# Altium schematic sheet PCIE_CLK.SchDoc: =project_title
size Tabloid; CompanyName: Luxonis Holding; Organization: Luxonis Holding; Address1: 1925 Harmony Park Drive; Address2: Westminster, CO; Address3: 80234; Address4: United States; SheetNumber: 4; SheetTotal: 15
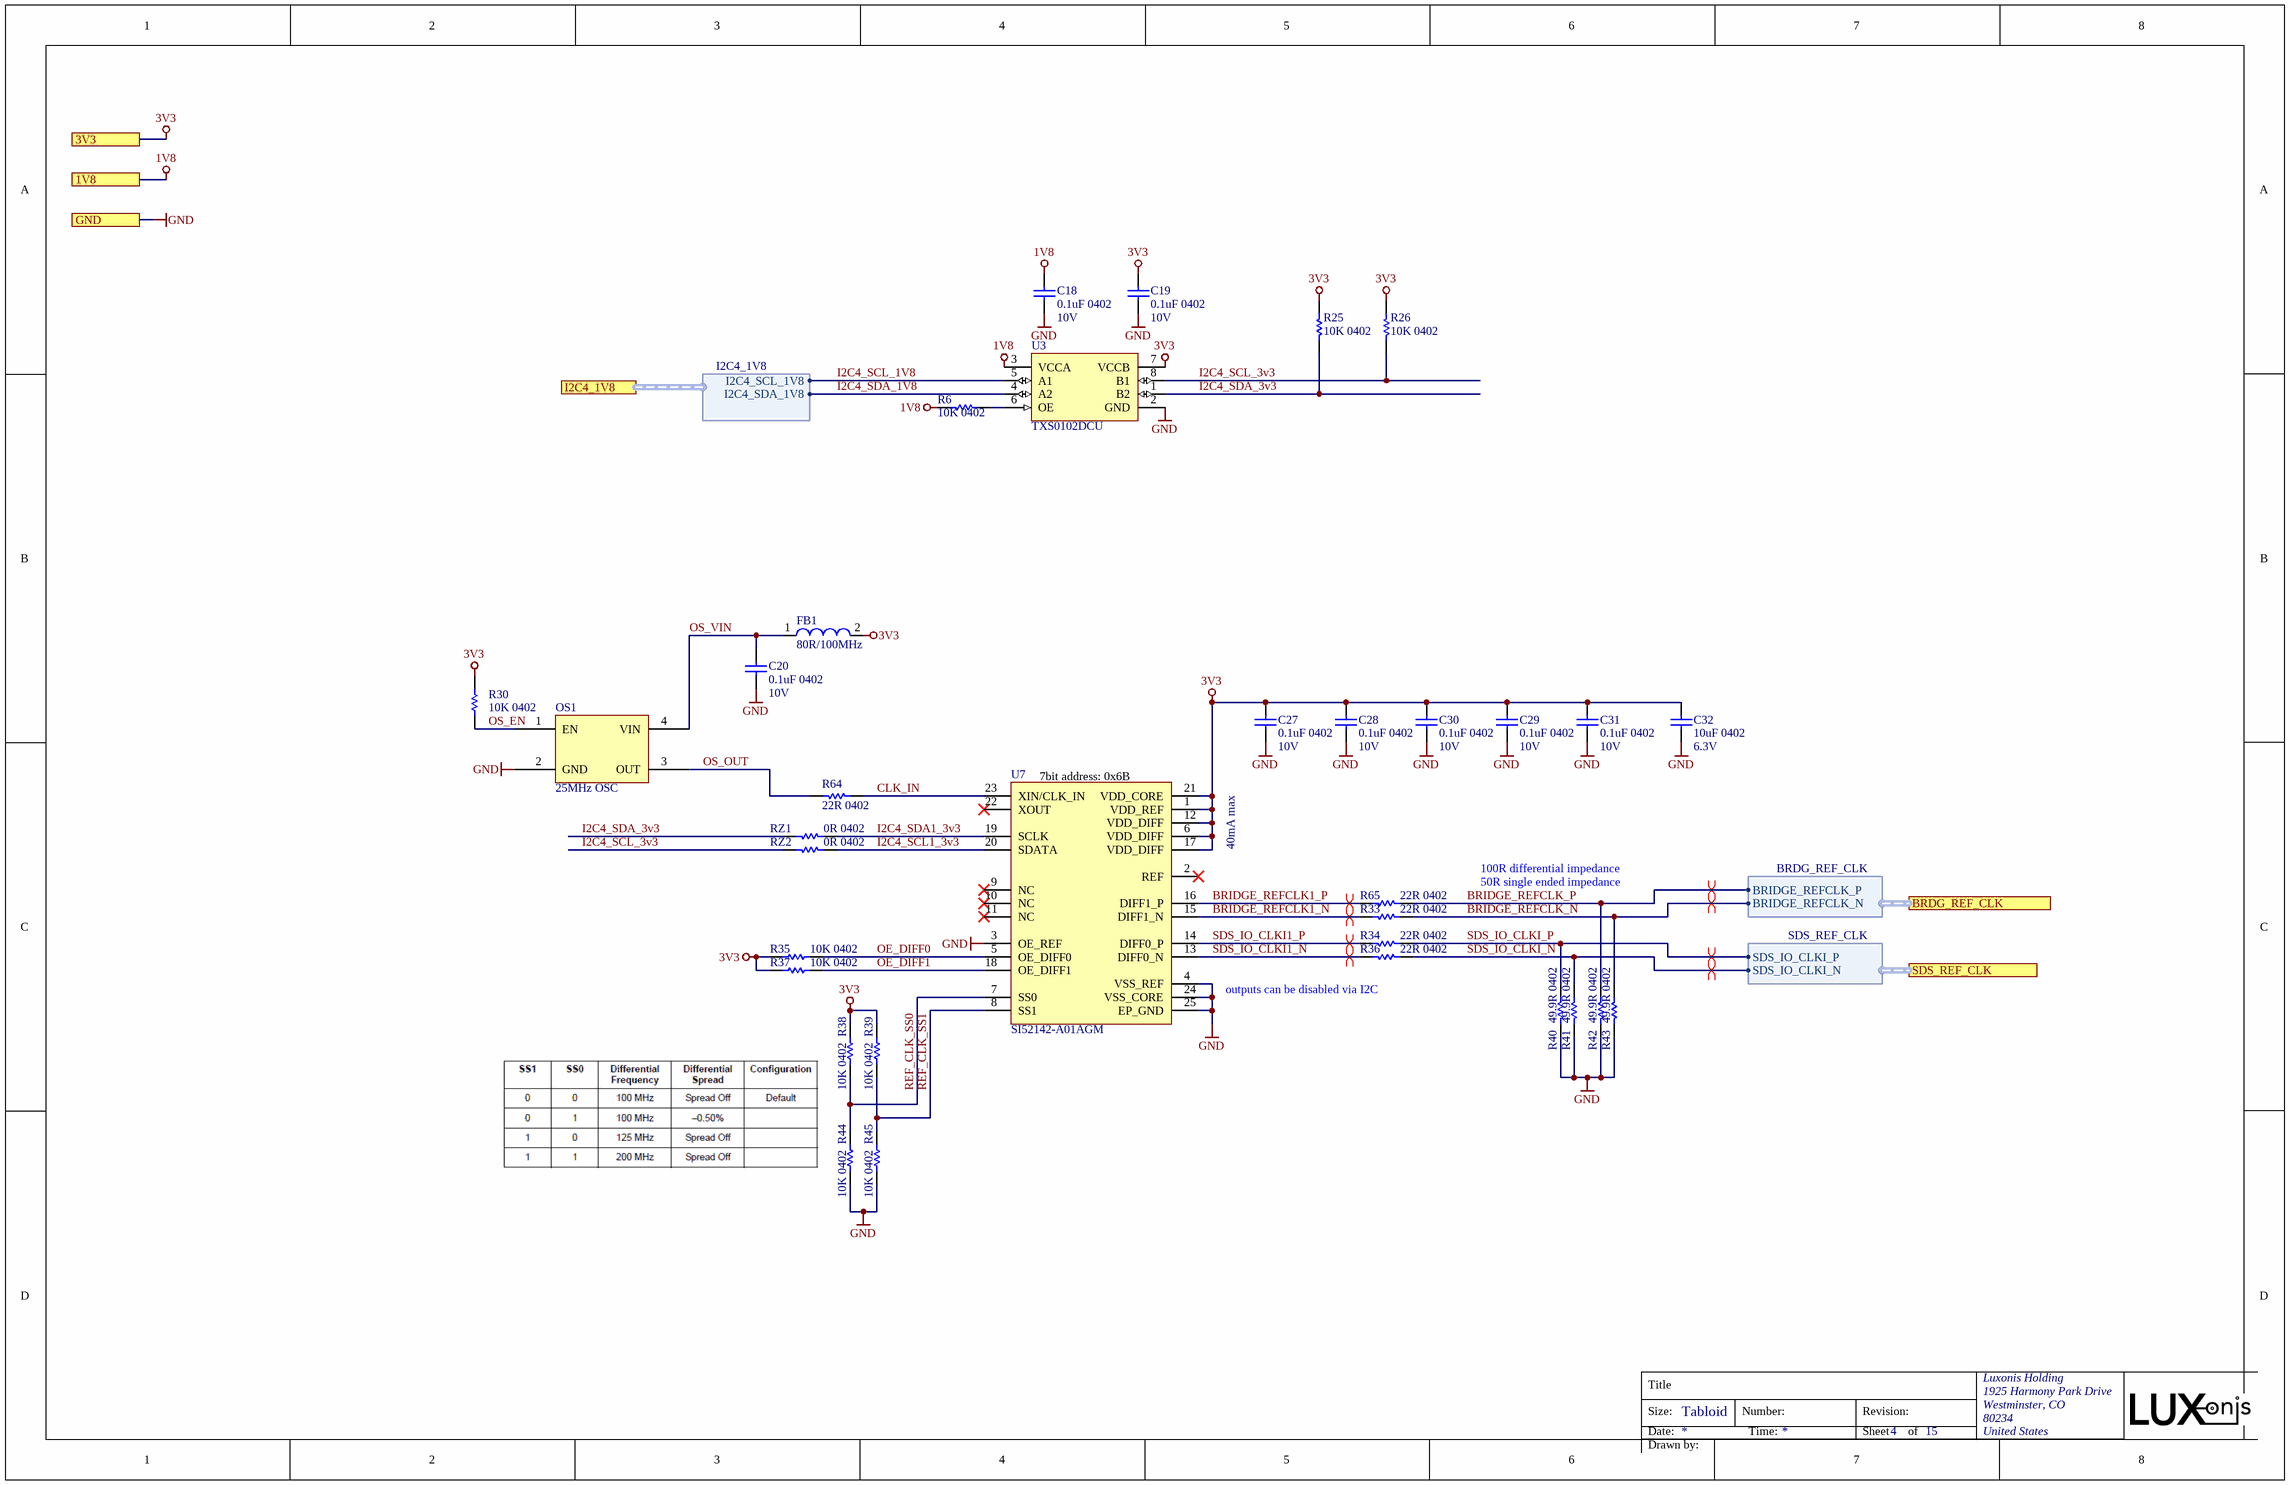
[diagram p0: PCIE_CLK.SchDoc]

## Parts
C18  0.1uF 0402  Voltage Rating: 10V  [CAPC0402(1005)70_N]
C19  0.1uF 0402  Voltage Rating: 10V  [CAPC0402(1005)70_N]
C20  0.1uF 0402  Voltage Rating: 10V  [CAPC0402(1005)70_N]
C27  0.1uF 0402  Voltage Rating: 10V  [CAPC0402(1005)70_N]
C28  0.1uF 0402  Voltage Rating: 10V  [CAPC0402(1005)70_N]
C29  0.1uF 0402  Voltage Rating: 10V  [CAPC0402(1005)70_N]
C30  0.1uF 0402  Voltage Rating: 10V  [CAPC0402(1005)70_N]
C31  0.1uF 0402  Voltage Rating: 10V  [CAPC0402(1005)70_N]
C32  10uF 0402  Voltage Rating: 6.3V  [CAPC0402(1005)70_N]
FB1  80R/100MHz  [BK1608HS800-T_N]
OS1  25MHz OSC  [ASDMB-25.000MHZ-LC-T]
R6  10K 0402  [RESC0402(1005)_N]
R25  10K 0402  [RESC0402(1005)_N]
R26  10K 0402  [RESC0402(1005)_N]
R30  10K 0402  [RESC0402(1005)_N]
R33  22R 0402  [RESC0402(1005)_L]
R34  22R 0402  [RESC0402(1005)_L]
R35  10K 0402  [RESC0402(1005)_N]
R36  22R 0402  [RESC0402(1005)_L]
R37  10K 0402  [RESC0402(1005)_N]
R38  10K 0402  [RESC0402(1005)_N]
R39  10K 0402  [RESC0402(1005)_N]
R40  49.9R 0402  [RESC0402(1005)_L]
R41  49.9R 0402  [RESC0402(1005)_L]
R42  49.9R 0402  [RESC0402(1005)_L]
R43  49.9R 0402  [RESC0402(1005)_L]
R44  10K 0402  [RESC0402(1005)_N]
R45  10K 0402  [RESC0402(1005)_N]
R64  22R 0402  [RESC0402(1005)_N]
R65  22R 0402  [RESC0402(1005)_L]
RZ1  0R 0402  [RESC0402(1005)_N]
RZ2  0R 0402  [RESC0402(1005)_N]
U3  TXS0102DCU  [TXS0102DCUR]
U7  SI52142-A01AGM  [SI52142-A01AGM]

## Ports
1V8, 3V3, BRDG_REF_CLK (harness BRDG_REF_CLK), GND, I2C4_1V8 (harness I2C4_1V8), SDS_REF_CLK (harness SDS_REF_CLK)

## Harnesses
BRDG_REF_CLK: BRIDGE_REFCLK_P, BRIDGE_REFCLK_N
SDS_REF_CLK: SDS_IO_CLKI_P, SDS_IO_CLKI_N
I2C4_1V8: I2C4_SDA_1V8, I2C4_SCL_1V8

## Nets
1V8: C18.2 R6.2 U3.3(VCCA) ; port 1V8
3V3: C19.2 C27.1 C28.1 C29.1 C30.1 C31.1 C32.2 FB1.2 R25.1 R26.1 R30.2 R35.1 R37.1 R38.1 R39.1 U3.7(VCCB) U7.1(VDD_REF) U7.6(VDD_DIFF) U7.12(VDD_DIFF) U7.17(VDD_DIFF) U7.21(VDD_CORE) ; port 3V3
GND: C18.1 C19.1 C20.2 C27.2 C28.2 C29.2 C30.2 C31.2 C32.1 OS1.2(GND) R40.2 R41.1 R42.1 R43.1 R44.2 R45.2 U3.2(GND) U7.3(OE_REF) U7.4(VSS_REF) U7.24(VSS_CORE) U7.25(EP_GND) ; port GND
BRIDGE_REFCLK1_N: R33.2 U7.15(DIFF1_N)
BRIDGE_REFCLK1_P: R65.2 U7.16(DIFF1_P)
BRIDGE_REFCLK_N: R33.1 R43.2 ; port BRDG_REF_CLK.BRIDGE_REFCLK_N
BRIDGE_REFCLK_P: R42.2 R65.1 ; port BRDG_REF_CLK.BRIDGE_REFCLK_P
CLK_IN: R64.1 U7.23(XIN/CLK_IN)
I2C4_SCL1_3v3: RZ2.2 U7.20(SDATA)
I2C4_SCL_1V8: U3.5(A1) ; port I2C4_1V8.I2C4_SCL_1V8
I2C4_SCL_3v3: R26.2 RZ2.1 U3.8(B1)
I2C4_SDA1_3v3: RZ1.2 U7.19(SCLK)
I2C4_SDA_1V8: U3.4(A2) ; port I2C4_1V8.I2C4_SDA_1V8
I2C4_SDA_3v3: R25.2 RZ1.1 U3.1(B2)
OE_DIFF0: R35.2 U7.5(OE_DIFF0)
OE_DIFF1: R37.2 U7.18(OE_DIFF1)
OS_EN: OS1.1(EN) R30.1
OS_OUT: OS1.3(OUT) R64.2
OS_VIN: C20.1 FB1.1 OS1.4(VIN)
REF_CLK_SS0: R38.2 R44.1 U7.7(SS0)
REF_CLK_SS1: R39.2 R45.1 U7.8(SS1)
SDS_IO_CLKI1_N: R36.2 U7.13(DIFF0_N)
SDS_IO_CLKI1_P: R34.2 U7.14(DIFF0_P)
SDS_IO_CLKI_N: R36.1 R41.2 ; port SDS_REF_CLK.SDS_IO_CLKI_N
SDS_IO_CLKI_P: R34.1 R40.1 ; port SDS_REF_CLK.SDS_IO_CLKI_P
NetR6_1: R6.1 U3.6(OE)

Not connected (* = marked no-connect by the designer): U7 2(REF)* 9(NC)* 10(NC)* 11(NC)* 22(XOUT)*

## Layout directives
differential pair; differential pair class 100ohm: BRIDGE_REFCLK1_N, BRIDGE_REFCLK1_P, BRIDGE_REFCLK_N, BRIDGE_REFCLK_P, SDS_IO_CLKI1_N, SDS_IO_CLKI1_P, SDS_IO_CLKI_N, SDS_IO_CLKI_P

## Notes on the sheet
- (near U7) 7bit address: 0x6B
- 40mA max
- 100R differential impedance
- 50R single ended impedance
- outputs can be disabled via I2C
- Schematic based on the PCIe refclk and control circuitry on the MV0235 reference design.
- Title
- Size:
- Date:
- Tabloid
- Number:
- Time:
- Revision:
- Sheet
- of
- Drawn by:

## Library data of the parts
C18-C20 C27-C31 = GRM155R71A104JA01D: CAP CER 0.1UF 10V X7R 0402 5%; Manufacturer 1: Murata; Capacitance: 100nF; Supplier 1: Digi-Key; Manufacturer Part Number 1: GRM155R71A104JA01D; Stock 1: 1346709; Pricing 1: 1=0.10000, 10=0.02500, 100=0.01130, 500=0.00806, 1000=0.00633, 2500=0.00575, 5000=0.00529 (USD); RoHS: Yes; Mount: Surface Mount; Case/Package: 0402; Case Code (Imperial): 0402; Case Code (Metric): 1005; Min Operating Temperature: -55°C; Max Operating Temperature: 125°C; Tolerance: 5%; Packaging: Tape and Reel; Voltage Rating (DC): 10V; Dielectric: X7R; Package Quantity: 10000; Termination: SMD/SMT; Length: 1mm; Height: 0.5mm; Width: 0.02inch; Thickness: 0.022inch; Depth: 0.5mm; Radiation Hardening: No; Lead Free: Lead Free; ComponentLink1URL: https://datasheet.ciiva.com/5411/product-5411135.pdf?src-supplier=Mouser; ComponentLink1Description: https://datasheet.ciiva.com/5411/product-5411135.pdf?src-supplier=Mouser; ComponentLink2URL: https://datasheet.ciiva.com/11618/c02e-11618821.pdf?src-supplier=Avnet; ComponentLink2Description: https://datasheet.ciiva.com/11618/c02e-11618821.pdf?src-supplier=Avnet; Supplier Part Number 1: 490-10777-1-ND
C32 = GRM155R60J106ME15D: CAP CER 10UF 6.3V X5R 0402 20%; Manufacturer 1: Murata; Supplier 1: Digi-Key; Manufacturer Part Number 1: GRM155R60J106ME15D; Stock 1: 1839627; Pricing 1: 1=0.23000, 10=0.15700, 100=0.07950, 500=0.05442, 1000=0.04814, 2500=0.04605, 5000=0.04186 (USD); RoHS: Yes; Mount: Surface Mount; Case/Package: 0402; Case Code (Metric): 1005; Case Code (Imperial): 0402; Min Operating Temperature: -55°C; Max Operating Temperature: 85°C; Packaging: Tape and Reel; Capacitance: 10uF; Dielectric: X5R; Length: 0.039inch; Width: 0.02inch; ComponentLink1URL: https://www.murata.com/~/media/webrenewal/support/library/catalog/products/capacitor/mlcc/c02e.ashx?la=en-us&src-supplier=Digi-Key; ComponentLink1Description: https://www.murata.com/~/media/webrenewal/support/library/catalog/products/capacitor/mlcc/c02e.ashx?la=en-us&src-supplier=Digi-Key; Supplier Part Number 1: 490-13238-1-ND; Voltage Rating (DC): 6.3V; Thickness: 0.026inch; Tolerance: 20%
FB1 = BK1608HS800-T: FERRITE BEAD 80 OHM 0603 1LN; Manufacturer 1: Taiyo Yuden; Impedance: 80R; Tolerance: 25%; Max DC Current: 600mA; DC Resistance (DCR): 100mR; Test Frequency: 100MHz; Number of Lines: 1; Shielding: Shielded; Supplier 1: Digi-Key; Manufacturer Part Number 1: BK1608HS800-T; Stock 1: 6285; Pricing 1: 1=0.10000, 10=0.07900, 25=0.07200, 50=0.06480, 100=0.04760, 250=0.03460, 500=0.03170, 1000=0.02738 (USD); RoHS: Yes; Mount: Surface Mount; Case/Package: 0603; Number of Pins: 2; Core Material: Ferrite; Case Code (Metric): 1608; Case Code (Imperial): 0603; Min Operating Temperature: -55°C; Max Operating Temperature: 125°C; Package Quantity: 1; Packaging: Tape and Reel; Termination: SMD/SMT; Max Current Rating: 600mA; Frequency: 100MHz; Length: 0.063inch; Height: 0.037inch; Width: 0.8mm; Depth: 0.95mm; REACH SVHC: Unknown; Lead Free: Lead Free; Halogen Free: Halogen Free; ComponentLink1URL: https://datasheet.ciiva.com/1011/bk1608hs800-t-ss-1011885.pdf?src-supplier=Digi-Key; ComponentLink1Description: https://datasheet.ciiva.com/1011/bk1608hs800-t-ss-1011885.pdf?src-supplier=Digi-Key; ComponentLink2URL: https://datasheet.ciiva.com/1011/mlci07-e-1011886.pdf?src-supplier=Digi-Key; ComponentLink2Description: https://datasheet.ciiva.com/1011/mlci07-e-1011886.pdf?src-supplier=Digi-Key; ComponentLink3URL: https://datasheet.ciiva.com/1011/mlci07-e-1011887.pdf?src-supplier=Digi-Key; ComponentLink3Description: https://datasheet.ciiva.com/1011/mlci07-e-1011887.pdf?src-supplier=Digi-Key; Supplier 2: Mouser; Supplier 3: Arrow; Supplier Part Number 1: 587-1875-1-ND; Supplier Part Number 2: 963-BK1608HS800-T; Supplier Part Number 3: BK1608HS800-T
OS1 = ASDMB-25.000MHZ-LC-T: MEMS OSC XO 25.0000MHZ LVCMOS; Manufacturer 1: Abracon; Load Capacitance: 15pF; Operating Supply Voltage: 3.3V; Max Supply Voltage: 4V; Min Supply Voltage: -300mV; Max Supply Current: 16mA; Frequency Stability: 50ppm; Supplier 1: Digi-Key; Manufacturer Part Number 1: ASDMB-25.000MHZ-LC-T; RoHS: Yes; Category: Oscillators; Stock 1: 3088; Pricing 1: 1=2.09000, 10=1.99800, 50=1.95200, 100=1.67310, 500=1.62662 (USD); Mount: Surface Mount; Case/Package: SMD/SMT; Number of Pins: 4; Min Operating Temperature: -40°C; Max Operating Temperature: 85°C; Packaging: Tape and Reel; Frequency: 25MHz; Termination: SMD/SMT; Length: 0.098inch; Height: 0.035inch; Width: 0.079inch; Lead Free: Lead Free; ComponentLink1URL: https://datasheet.ciiva.com/868/asdmb-868249.pdf?src-supplier=Digi-Key; ComponentLink1Description: https://datasheet.ciiva.com/868/asdmb-868249.pdf?src-supplier=Digi-Key; ComponentLink2URL: https://datasheet.ciiva.com/868/asdmb-868250.pdf?src-supplier=Digi-Key; ComponentLink2Description: https://datasheet.ciiva.com/868/asdmb-868250.pdf?src-supplier=Digi-Key; ComponentLink3URL: https://datasheet.ciiva.com/868/asdmb-868251.pdf?src-supplier=Digi-Key; ComponentLink3Description: https://datasheet.ciiva.com/868/asdmb-868251.pdf?src-supplier=Digi-Key; ComponentLink4URL: https://datasheet.ciiva.com/13166/asdmb-29928-13166571.pdf?src-supplier=Mouser; ComponentLink4Description: https://datasheet.ciiva.com/13166/asdmb-29928-13166571.pdf?src-supplier=Mouser; Supplier 2: Newark; Supplier 3: Mouser; Supplier Part Number 3: 815-ASDMB-25MHZ-LC; Supplier Part Number 2: 56AC7555; Supplier Part Number 1: 535-11730-1-ND
R6 R25 R26 R30 R35 R37-R39 R44 R45 = RC0402FR-1310KL: RES SMD 10K OHM 1% 0402 1/16W Chip Resistor, 0402 [1005 Metric], 10 kohm, RC Series, 50 V, Thick Film, 62.5 mW; Manufacturer 1: Yageo; Resistance: 10kR; Temperature Coefficient: 100ppm/°C; Power Rating: 62.5mW; Voltage Rating: 50V; ComponentLink1URL: https://datasheet.ciiva.com/16940/pyu-rc0402-51-rohs-l-6-16940293.pdf?src-supplier=Avnet+Europe; ComponentLink1Description: https://datasheet.ciiva.com/16940/pyu-rc0402-51-rohs-l-6-16940293.pdf?src-supplier=Avnet+Europe; ComponentLink2URL: https://datasheet.ciiva.com/28386/pyu-rc0402-51-rohs-l-6-28386855.pdf?src-supplier=Avnet+Europe; ComponentLink2Description: https://datasheet.ciiva.com/28386/pyu-rc0402-51-rohs-l-6-28386855.pdf?src-supplier=Avnet+Europe; ComponentLink3URL: https://datasheet.ciiva.com/16740/pyu-rc0402-51-rohs-l-6-r-16740602.pdf?src-supplier=Future+Electronics; ComponentLink3Description: https://datasheet.ciiva.com/16740/pyu-rc0402-51-rohs-l-6-r-16740602.pdf?src-supplier=Future+Electronics; ComponentLink4URL: https://datasheet.ciiva.com/8891/pyu-rc0402-51-rohs-l-6-8891339.pdf?src-supplier=Avnet; ComponentLink4Description: https://datasheet.ciiva.com/8891/pyu-rc0402-51-rohs-l-6-8891339.pdf?src-supplier=Avnet; ComponentLink5URL: https://datasheet.ciiva.com/5557/pyu-rc0402-51-rohs-l-6-r-5557997.pdf?src-supplier=Mouser; ComponentLink5Description: https://datasheet.ciiva.com/5557/pyu-rc0402-51-rohs-l-6-r-5557997.pdf?src-supplier=Mouser; ComponentLink6URL: https://datasheet.ciiva.com/7983/1018594-7983533.pdf?src-supplier=Element14; ComponentLink6Description: https://datasheet.ciiva.com/7983/1018594-7983533.pdf?src-supplier=Element14; Supplier 1: Newark; Manufacturer Part Number 1: RC0402FR-1310KL; Stock 1: 62239; Pricing 1: 1=0.10000, 25=0.01200, 100=0.00400, 250=0.00400, 500=0.00300, 1000=0.00300 (USD); RoHS: Yes; Case/Package: 0402; Number of Pins: 2; Contact Plating: Tin,Matte,Lead; Case Code (Imperial): 0402; Case Code (Metric): 1005; Min Operating Temperature: -55°C; Max Operating Temperature: 155°C; Tolerance: 1%; Composition: Thick Film; Packaging: Tape and Reel; Termination: SMD/SMT; Military Standard: Not; Voltage Rating (DC): 50V; Working Voltage: 50V; Number of Terminations: 2; Length: 1mm; Depth: 0.5mm; Radiation Hardening: No; REACH SVHC: No SVHC; Lead Free: Lead Free; Supplier Part Number 1: 67R9960; Supplier 2: Future Electronics; Supplier 3: Mouser; Supplier 4: Element14; Supplier Part Number 2: RC0402FR-1310KL-CUTT; Supplier Part Number 3: 603-RC0402FR-1310KL; Supplier Part Number 4: 1799235
R33 R34 R36 R64 R65 = RC0402FR-0722RL: RES SMD 22 OHM 1% 1/16W 0402; Manufacturer 1: Yageo; Temperature Coefficient: 100ppm/°C; Power Rating: 63mW; Voltage Rating: 50V; Supplier 1: Digi-Key; Manufacturer Part Number 1: RC0402FR-0722RL; Stock 1: 23751364; Pricing 1: 10000=0.00163, 30000=0.00144, 50000=0.00132, 100000=0.00129 (USD); RoHS: Yes; Case/Package: 0402; Number of Pins: 2; Case Code (Metric): 1005; Case Code (Imperial): 0402; Min Operating Temperature: -55°C; Max Operating Temperature: 155°C; Tolerance: 1%; Resistance: 22R; Packaging: Tape and Reel; Composition: Thick Film; Voltage Rating (DC): 50V; Termination: SMD/SMT; Military Standard: Not; Length: 1mm; Height: 0.32mm; Width: 0.5mm; Depth: 0.5mm; REACH SVHC: Unknown; Lead Free: Lead Free; ComponentLink1URL: https://datasheet.ciiva.com/11819/0900766b80c66297-11819462.pdf?src-supplier=RSComponents; ComponentLink1Description: https://datasheet.ciiva.com/11819/0900766b80c66297-11819462.pdf?src-supplier=RSComponents; ComponentLink2URL: https://datasheet.ciiva.com/7849/1018594-7849911.pdf?src-supplier=Element14; ComponentLink2Description: https://datasheet.ciiva.com/7849/1018594-7849911.pdf?src-supplier=Element14; ComponentLink3URL: https://datasheet.ciiva.com/26829/getdatasheetpartid-554995-26829991.pdf?src-supplier=Verical; ComponentLink3Description: https://datasheet.ciiva.com/26829/getdatasheetpartid-554995-26829991.pdf?src-supplier=Verical; ComponentLink4URL: https://datasheet.ciiva.com/7849/1018594-7849912.pdf?src-supplier=Element14; ComponentLink4Description: https://datasheet.ciiva.com/7849/1018594-7849912.pdf?src-supplier=Element14; ComponentLink5URL: https://datasheet.ciiva.com/16930/pyu-rc0402-51-rohs-l-6-r-16930687.pdf?src-supplier=Future+Electronics; ComponentLink5Description: https://datasheet.ciiva.com/16930/pyu-rc0402-51-rohs-l-6-r-16930687.pdf?src-supplier=Future+Electronics; Supplier 2: Newark; Supplier 3: Mouser; Supplier Part Number 2: 26M6784; Supplier Part Number 3: 603-RC0402FR-0722RL; Supplier Part Number 1: 311-22.0LRTR-ND
R40-R43 = RC0402FR-0749R9L: RES SMD 49.9 OHM 1% 1/16W 0402; Manufacturer 1: Yageo; Power Rating: 62.5mW; Temperature Coefficient: 100ppm/°C; Voltage Rating: 50V; Max Power Dissipation: 63mW; Supplier 1: Digi-Key; Manufacturer Part Number 1: RC0402FR-0749R9L; Stock 1: 15110719; Pricing 1: 1=0.10000, 10=0.01600, 100=0.00640, 1000=0.00289, 2500=0.00251, 5000=0.00207 (USD); RoHS: Yes; Case/Package: 0402; Number of Pins: 2; Case Code (Imperial): 0402; Case Code (Metric): 1005; Min Operating Temperature: -55°C; Max Operating Temperature: 155°C; Packaging: Tape and Reel; Resistance: 49.9R; Tolerance: 1%; Composition: Thick Film; Number of Terminations: 2; Package Quantity: 1; Termination: SMD/SMT; Military Standard: Not; Voltage Rating (DC): 50V; Features: Moisture Resistant; Working Voltage: 50V; Length: 1mm; Height: 0.016inch; Width: 0.5mm; Depth: 0.5mm; Lead Free: Lead Free; REACH SVHC: No SVHC; ComponentLink1URL: https://datasheet.ciiva.com/11819/0900766b80c66297-11819508.pdf?src-supplier=RSComponents; ComponentLink1Description: https://datasheet.ciiva.com/11819/0900766b80c66297-11819508.pdf?src-supplier=RSComponents; ComponentLink2URL: https://datasheet.ciiva.com/7983/1018594-7983542.pdf?src-supplier=Element14; ComponentLink2Description: https://datasheet.ciiva.com/7983/1018594-7983542.pdf?src-supplier=Element14; ComponentLink3URL: https://datasheet.ciiva.com/16743/pyu-rc0402-51-rohs-l-6-r-16743942.pdf?src-supplier=Future+Electronics; ComponentLink3Description: https://datasheet.ciiva.com/16743/pyu-rc0402-51-rohs-l-6-r-16743942.pdf?src-supplier=Future+Electronics; ComponentLink4URL: https://datasheet.ciiva.com/22747/1018594-22747514.pdf?src-supplier=Element14; ComponentLink4Description: https://datasheet.ciiva.com/22747/1018594-22747514.pdf?src-supplier=Element14; ComponentLink5URL: https://datasheet.ciiva.com/2453/pyu-r-int-thick-7-2453355.pdf?src-supplier=Digi-Key; ComponentLink5Description: https://datasheet.ciiva.com/2453/pyu-r-int-thick-7-2453355.pdf?src-supplier=Digi-Key; ComponentLink6URL: https://datasheet.ciiva.com/2453/pyu-r-int-thick-7-2453356.pdf?src-supplier=Digi-Key; ComponentLink6Description: https://datasheet.ciiva.com/2453/pyu-r-int-thick-7-2453356.pdf?src-supplier=Digi-Key; ComponentLink7URL: https://datasheet.ciiva.com/2453/pyu-r-int-thick-7-2453357.pdf?src-supplier=Digi-Key; ComponentLink7Description: https://datasheet.ciiva.com/2453/pyu-r-int-thick-7-2453357.pdf?src-supplier=Digi-Key; Supplier 2: Mouser; Supplier Part Number 1: 311-49.9LRCT-ND; Supplier Part Number 2: 603-RC0402FR-0749R9L
RZ1 RZ2 = CRCW04020000Z0ED: RES SMD 0 OHM JUMPER 1/16W 0402; Manufacturer 1: Vishay; Resistance: 0mR; Power Rating: 63mW; Voltage Rating: 50V; Temperature Coefficient: 100ppm/°C; Tolerance: 5%; Supplier 1: Digi-Key; Manufacturer Part Number 1: CRCW04020000Z0ED; Stock 1: 855968; Pricing 1: 1=0.10000, 10=0.03400, 25=0.02440, 50=0.01860, 100=0.01380, 250=0.01048, 500=0.00840, 1000=0.00618, 5000=0.00443 (USD); RoHS: Yes; Mount: Surface Mount; Case/Package: 0402; Weight: 2.3E-05oz; Case Code (Imperial): 0402; Case Code (Metric): 1005; Contact Plating: Tin; Min Operating Temperature: -55°C; Max Operating Temperature: 155°C; Packaging: Tape and Reel; Composition: Thick Film; Voltage Rating (DC): 50V; Package Quantity: 1; Termination: SMD/SMT; Number of Terminations: 2; Military Standard: Not; Max Power Dissipation: 63mW; Features: Automotive AEC-Q200; Length: 1mm; Height: 0.35mm; Width: 0.5mm; Depth: 0.5mm; Radiation Hardening: No; REACH SVHC: Unknown; Lead Free: Lead Free; ComponentLink1URL: https://datasheet.ciiva.com/3255/dcrcwe3-3255944.pdf?src-supplier=Avnet; ComponentLink1Description: https://datasheet.ciiva.com/3255/dcrcwe3-3255944.pdf?src-supplier=Avnet; ComponentLink2URL: https://datasheet.ciiva.com/3255/dcrcwe3-3255945.pdf?src-supplier=Avnet; ComponentLink2Description: https://datasheet.ciiva.com/3255/dcrcwe3-3255945.pdf?src-supplier=Avnet; ComponentLink3URL: https://datasheet.ciiva.com/16881/dcrcwe3-16881413.pdf?src-supplier=Avnet+Europe; ComponentLink3Description: https://datasheet.ciiva.com/16881/dcrcwe3-16881413.pdf?src-supplier=Avnet+Europe; ComponentLink4URL: https://datasheet.ciiva.com/2461/dcrcwe3-2461962.pdf?src-supplier=Digi-Key; ComponentLink4Description: https://datasheet.ciiva.com/2461/dcrcwe3-2461962.pdf?src-supplier=Digi-Key; ComponentLink5URL: https://datasheet.ciiva.com/7841/1720486-7841802.pdf?src-supplier=Element14; ComponentLink5Description: https://datasheet.ciiva.com/7841/1720486-7841802.pdf?src-supplier=Element14; ComponentLink6URL: https://datasheet.ciiva.com/2461/dcrcwe3-2461963.pdf?src-supplier=Digi-Key; ComponentLink6Description: https://datasheet.ciiva.com/2461/dcrcwe3-2461963.pdf?src-supplier=Digi-Key; ComponentLink7URL: https://datasheet.ciiva.com/2461/dcrcwe3-2461964.pdf?src-supplier=Digi-Key; ComponentLink7Description: https://datasheet.ciiva.com/2461/dcrcwe3-2461964.pdf?src-supplier=Digi-Key; ComponentLink8URL: https://datasheet.ciiva.com/7841/1697337-7841468.pdf?src-supplier=Element14; ComponentLink8Description: https://datasheet.ciiva.com/7841/1697337-7841468.pdf?src-supplier=Element14; ComponentLink9URL: https://datasheet.ciiva.com/16761/70200976-16761309.pdf?src-supplier=Allied+Electronics; ComponentLink9Description: https://datasheet.ciiva.com/16761/70200976-16761309.pdf?src-supplier=Allied+Electronics; ComponentLink10URL: https://datasheet.ciiva.com/26311/fld-crcw-e3-data-en-26311550.pdf?src-supplier=Distrelec; ComponentLink10Description: https://datasheet.ciiva.com/26311/fld-crcw-e3-data-en-26311550.pdf?src-supplier=Distrelec; Supplier Part Number 1: 541-0.0JCT-ND
U3 = TXS0102DCUR: TEXAS INSTRUMENTS - TXS0102DCUR - IC, TRANSLATOR, 2 BIT, BI, US-8; Min Supply Voltage: 1.65V; Max Supply Voltage: 5.5V; Data Rate: 24Mbps; Number of Channels: 2; Propagation Delay: 4.6ns; Turn-On Delay Time: 260ns; High Level Output Current: -20uA; Low Level Output Current: 1mA; Quiescent Current: 14.4uA; Output Type: Voltage; Output Current: 1A; Supplier 1: Digi-Key; Manufacturer 1: Texas Instruments; Manufacturer Part Number 1: TXS0102DCUR; RoHS: Yes; Category: Logic Gates; Stock 1: 55123; Pricing 1: 1=0.75000, 10=0.65900, 25=0.61960, 100=0.50550, 250=0.46956, 500=0.39964, 1000=0.31971 (USD); Case/Package: VSSOP; Number of Pins: 8; Weight: 0.000339oz; Min Operating Temperature: -40°C; Max Operating Temperature: 85°C; Package Quantity: 1; Packaging: Tape and Reel; Logic Function: Translator; Number of Bits: 2; Number of Inputs: 2; Nominal Supply Current: 14.4uA; Radiation Hardening: No; Lead Free: Lead Free; REACH SVHC: No SVHC; ComponentLink1URL: https://datasheet.ciiva.com/15096/getdatasheetpartid-118249-15096172.pdf?src-supplier=Verical; ComponentLink1Description: https://datasheet.ciiva.com/15096/getdatasheetpartid-118249-15096172.pdf?src-supplier=Verical; ComponentLink2URL: https://datasheet.ciiva.com/22653/1846850-22653373.pdf?src-supplier=Farnell; ComponentLink2Description: https://datasheet.ciiva.com/22653/1846850-22653373.pdf?src-supplier=Farnell; ComponentLink3URL: https://datasheet.ciiva.com/1508/1857232-1508821.pdf?src-supplier=Element14; ComponentLink3Description: https://datasheet.ciiva.com/1508/1857232-1508821.pdf?src-supplier=Element14; ComponentLink4URL: https://datasheet.ciiva.com/1899/txs0102-1899368.pdf?src-supplier=Digi-Key; ComponentLink4Description: https://datasheet.ciiva.com/1899/txs0102-1899368.pdf?src-supplier=Digi-Key; ComponentLink5URL: https://datasheet.ciiva.com/1899/txs0102-1899369.pdf?src-supplier=Digi-Key; ComponentLink5Description: https://datasheet.ciiva.com/1899/txs0102-1899369.pdf?src-supplier=Digi-Key; ComponentLink6URL: https://datasheet.ciiva.com/1899/txs0102-1899370.pdf?src-supplier=Digi-Key; ComponentLink6Description: https://datasheet.ciiva.com/1899/txs0102-1899370.pdf?src-supplier=Digi-Key; ComponentLink7URL: https://datasheet.ciiva.com/14287/txs0102-14287516.pdf?src-supplier=Avnet; ComponentLink7Description: https://datasheet.ciiva.com/14287/txs0102-14287516.pdf?src-supplier=Avnet; ComponentLink8URL: https://datasheet.ciiva.com/28499/1863639-28499676.pdf?src-supplier=Element14; ComponentLink8Description: https://datasheet.ciiva.com/28499/1863639-28499676.pdf?src-supplier=Element14; ComponentLink9URL: https://datasheet.ciiva.com/14287/txs0102-14287518.pdf?src-supplier=Avnet; ComponentLink9Description: https://datasheet.ciiva.com/14287/txs0102-14287518.pdf?src-supplier=Avnet; ComponentLink10URL: https://datasheet.ciiva.com/46395/1863639-46395871.pdf?src-supplier=Element14; ComponentLink10Description: https://datasheet.ciiva.com/46395/1863639-46395871.pdf?src-supplier=Element14; Supplier 2: Newark; Supplier 3: Mouser; Supplier Part Number 1: 296-21931-1-ND; Supplier Part Number 2: 30M1878; Supplier Part Number 3: 595-TXS0102DCUR
U7 = SI52142-A01AGM: IC CLK GENERATOR 200MHZ 24QFN; Manufacturer 1: Silicon Labs; Number of Outputs: 2; Operating Supply Voltage: 3.3V; Number of Circuits: 1; Max Duty Cycle: 55%; Input: Clock; PLL: Yes; Frequency: 100MHz; Min Supply Voltage: 3.135V; Max Supply Voltage: 3.465V; Supplier 1: Digi-Key; Manufacturer Part Number 1: SI52142-A01AGM; RoHS: Yes; Category: Clock and Timing; Stock 1: 398; Pricing 1: 1=1.81000, 25=1.66320, 100=1.51200, 1000=1.36080 (USD); Case/Package: QFN; Number of Pins: 24; Min Operating Temperature: -40°C; Max Operating Temperature: 85°C; Package Quantity: 490; Packaging: Tray; Max Frequency: 200MHz; Length: 4mm; Height: 0.75mm; Width: 4mm; Radiation Hardening: No; REACH SVHC: Unknown; ComponentLink1URL: https://datasheet.ciiva.com/1178/si52142-1178690.pdf?src-supplier=Digi-Key; ComponentLink1Description: https://datasheet.ciiva.com/1178/si52142-1178690.pdf?src-supplier=Digi-Key; ComponentLink2URL: https://datasheet.ciiva.com/26919/getdatasheetpartid-550913-26919827.pdf?src-supplier=Verical; ComponentLink2Description: https://datasheet.ciiva.com/26919/getdatasheetpartid-550913-26919827.pdf?src-supplier=Verical; ComponentLink3URL: https://datasheet.ciiva.com/46413/1813417-46413349.pdf?src-supplier=Element14; ComponentLink3Description: https://datasheet.ciiva.com/46413/1813417-46413349.pdf?src-supplier=Element14; ComponentLink4URL: https://datasheet.ciiva.com/4771/si52142-4771159.pdf?src-supplier=Mouser; ComponentLink4Description: https://datasheet.ciiva.com/4771/si52142-4771159.pdf?src-supplier=Mouser; Supplier 2: Mouser; Supplier 3: Newark; Supplier Part Number 1: 336-2157-ND; Supplier Part Number 3: 54X5497; Supplier Part Number 2: 634-SI52142A01A-GM